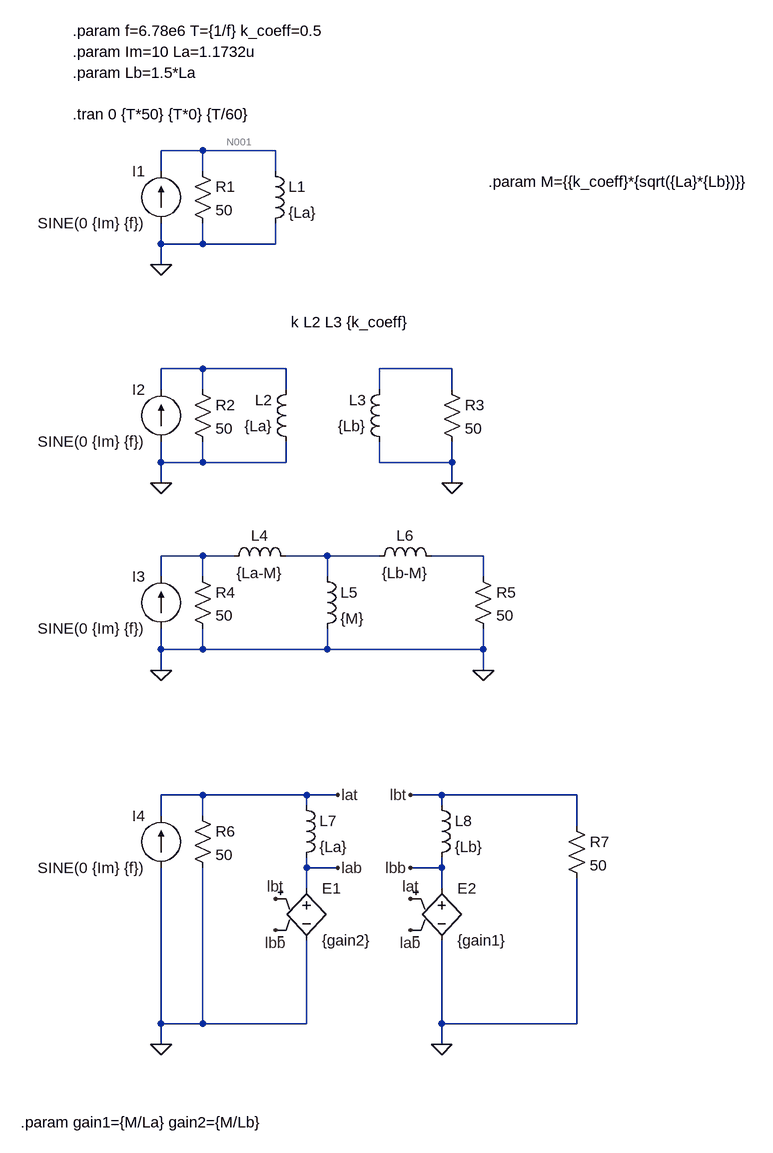
[diagram p0: schematic ipt1.asc]
ipt1.asc, the LTspice schematic file:
Version 4.1
SHEET 1 1076 1592
WIRE 128 80 64 80
WIRE 240 80 128 80
WIRE 64 112 64 80
WIRE 128 112 128 80
WIRE 240 112 240 80
WIRE 64 224 64 192
WIRE 128 224 128 192
WIRE 128 224 64 224
WIRE 240 224 240 192
WIRE 240 224 128 224
WIRE 64 256 64 224
WIRE 128 416 64 416
WIRE 256 416 128 416
WIRE 512 416 400 416
WIRE 64 448 64 416
WIRE 128 448 128 416
WIRE 256 448 256 416
WIRE 400 448 400 416
WIRE 512 448 512 416
WIRE 64 560 64 528
WIRE 128 560 128 528
WIRE 128 560 64 560
WIRE 256 560 256 528
WIRE 256 560 128 560
WIRE 400 560 400 528
WIRE 512 560 512 528
WIRE 512 560 400 560
WIRE 64 592 64 560
WIRE 512 592 512 560
WIRE 128 704 64 704
WIRE 176 704 128 704
WIRE 320 704 256 704
WIRE 400 704 320 704
WIRE 560 704 480 704
WIRE 64 736 64 704
WIRE 128 736 128 704
WIRE 320 736 320 704
WIRE 560 736 560 704
WIRE 64 848 64 816
WIRE 128 848 128 816
WIRE 128 848 64 848
WIRE 320 848 320 816
WIRE 320 848 128 848
WIRE 560 848 560 816
WIRE 560 848 320 848
WIRE 64 880 64 848
WIRE 560 880 560 848
WIRE 128 1072 64 1072
WIRE 288 1072 128 1072
WIRE 336 1072 288 1072
WIRE 496 1072 448 1072
WIRE 704 1072 496 1072
WIRE 288 1088 288 1072
WIRE 496 1088 496 1072
WIRE 64 1104 64 1072
WIRE 128 1104 128 1072
WIRE 704 1120 704 1072
WIRE 288 1184 288 1168
WIRE 336 1184 288 1184
WIRE 496 1184 496 1168
WIRE 496 1184 448 1184
WIRE 288 1216 288 1184
WIRE 496 1216 496 1184
WIRE 64 1424 64 1184
WIRE 128 1424 128 1184
WIRE 128 1424 64 1424
WIRE 288 1424 288 1296
WIRE 288 1424 128 1424
WIRE 496 1424 496 1296
WIRE 704 1424 704 1200
WIRE 704 1424 496 1424
WIRE 64 1456 64 1424
WIRE 496 1456 496 1424
FLAG 64 256 0
FLAG 64 592 0
FLAG 512 592 0
FLAG 64 880 0
FLAG 560 880 0
FLAG 64 1456 0
FLAG 496 1456 0
FLAG 336 1184 lab
FLAG 336 1072 lat
FLAG 448 1072 lbt
FLAG 448 1184 lbb
FLAG 240 1280 lbb
FLAG 240 1232 lbt
FLAG 448 1280 lab
FLAG 448 1232 lat
SYMBOL current 64 192 R180
WINDOW 0 24 80 Left 2
WINDOW 3 24 0 Left 2
WINDOW 123 0 0 Left 0
WINDOW 39 0 0 Left 0
SYMATTR InstName I1
SYMATTR Value SINE(0 {Im} {f})
SYMBOL ind 224 96 R0
SYMATTR InstName L1
SYMATTR Value {La}
SYMATTR SpiceLine Rser=1m
SYMBOL res 112 96 R0
SYMATTR InstName R1
SYMATTR Value 50
SYMBOL current 64 528 R180
WINDOW 0 24 80 Left 2
WINDOW 3 24 0 Left 2
WINDOW 123 0 0 Left 0
WINDOW 39 0 0 Left 0
SYMATTR InstName I2
SYMATTR Value SINE(0 {Im} {f})
SYMBOL ind 272 544 R180
WINDOW 0 36 80 Left 2
WINDOW 3 36 40 Left 2
SYMATTR InstName L2
SYMATTR Value {La}
SYMATTR Type ind
SYMATTR SpiceLine Rser=1m
SYMBOL res 112 432 R0
SYMATTR InstName R2
SYMATTR Value 50
SYMBOL ind 416 544 R180
WINDOW 0 36 80 Left 2
WINDOW 3 36 40 Left 2
SYMATTR InstName L3
SYMATTR Value {Lb}
SYMATTR Type ind
SYMATTR SpiceLine Rser=1m
SYMBOL res 496 432 R0
SYMATTR InstName R3
SYMATTR Value 50
SYMBOL current 64 816 R180
WINDOW 0 24 80 Left 2
WINDOW 3 24 0 Left 2
WINDOW 123 0 0 Left 0
WINDOW 39 0 0 Left 0
SYMATTR InstName I3
SYMATTR Value SINE(0 {Im} {f})
SYMBOL res 112 720 R0
SYMATTR InstName R4
SYMATTR Value 50
SYMBOL res 544 720 R0
SYMATTR InstName R5
SYMATTR Value 50
SYMBOL ind 160 720 R270
WINDOW 0 32 56 VTop 2
WINDOW 3 5 56 VBottom 2
SYMATTR InstName L4
SYMATTR Value {La-M}
SYMATTR SpiceLine Rser=1m
SYMBOL ind 304 720 R0
SYMATTR InstName L5
SYMATTR Value {M}
SYMATTR SpiceLine Rser=1m
SYMBOL ind 384 720 R270
WINDOW 0 32 56 VTop 2
WINDOW 3 5 56 VBottom 2
SYMATTR InstName L6
SYMATTR Value {Lb-M}
SYMATTR SpiceLine Rser=1m
SYMBOL current 64 1184 R180
WINDOW 0 24 80 Left 2
WINDOW 3 24 0 Left 2
WINDOW 123 0 0 Left 0
WINDOW 39 0 0 Left 0
SYMATTR InstName I4
SYMATTR Value SINE(0 {Im} {f})
SYMBOL res 112 1088 R0
SYMATTR InstName R6
SYMATTR Value 50
SYMBOL ind 272 1072 R0
SYMATTR InstName L7
SYMATTR Value {La}
SYMATTR SpiceLine Rser=1m
SYMBOL ind 480 1072 R0
SYMATTR InstName L8
SYMATTR Value {Lb}
SYMATTR SpiceLine Rser=1m
SYMBOL e 288 1200 R0
SYMATTR InstName E1
SYMATTR Value {gain2}
SYMBOL e 496 1200 R0
SYMATTR InstName E2
SYMATTR Value {gain1}
SYMBOL res 688 1104 R0
SYMATTR InstName R7
SYMATTR Value 50
TEXT -72 -72 Left 2 !.param Im=10 La=1.1732u
TEXT -72 -104 Left 2 !.param f=6.78e6 T={1/f} k_coeff=0.5
TEXT -72 24 Left 2 !.tran 0 {T*50} {T*0} {T/60}
TEXT 264 344 Left 2 !k L2 L3 {k_coeff}
TEXT 568 128 Left 2 !.param M={{k_coeff}*{sqrt({La}*{Lb})}}
TEXT -152 1576 Left 2 !.param gain1={M/La} gain2={M/Lb}
TEXT -72 -40 Left 2 !.param Lb=1.5*La

The netlist it stands for:
* ipt1.asc
I1 0 N001 SINE(0 {Im} {f})
L1 N001 0 {La} Rser=1m
R1 N001 0 50
I2 0 N002 SINE(0 {Im} {f})
L2 0 N002 {La} Rser=1m
R2 N002 0 50
L3 0 N003 {Lb} Rser=1m
R3 N003 0 50
I3 0 N004 SINE(0 {Im} {f})
R4 N004 0 50
R5 N006 0 50
L4 N004 N005 {La-M} Rser=1m
L5 N005 0 {M} Rser=1m
L6 N005 N006 {Lb-M} Rser=1m
I4 0 lat SINE(0 {Im} {f})
R6 lat 0 50
L7 lat lab {La} Rser=1m
L8 lbt lbb {Lb} Rser=1m
E1 lab 0 lbt lbb {gain2}
E2 lbb 0 lat lab {gain1}
R7 lbt 0 50
.param Im=10 La=1.1732u
.param f=6.78e6 T={1/f} k_coeff=0.5
.tran 0 {T*50} {T*0} {T/60}
k L2 L3 {k_coeff}
.param M={{k_coeff}*{sqrt({La}*{Lb})}}
.param gain1={M/La} gain2={M/Lb}
.param Lb=1.5*La
.backanno
.end

* Results of the author's LTspice run, read from the files saved beside the schematic
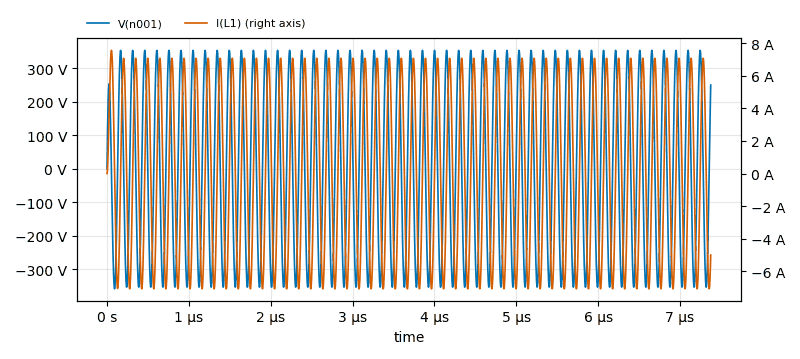
[diagram p1: Transient Analysis of ipt1.asc, plotted from the saved traces]
* Transient Analysis, 1 run:
*   V(n001): min -358.6 V, max 353.6 V, average -795.4 mV, rms 249.5 V, last 250 V
*   I(L1): min -7.069 A, max 7.554 A, average 15.91 mA, rms 5.003 A, last -5 A